# EAGLE schematic HElikopterPlusKomplett (EAGLE 7.5.0)

## Sheet 1 of 2: Full Version
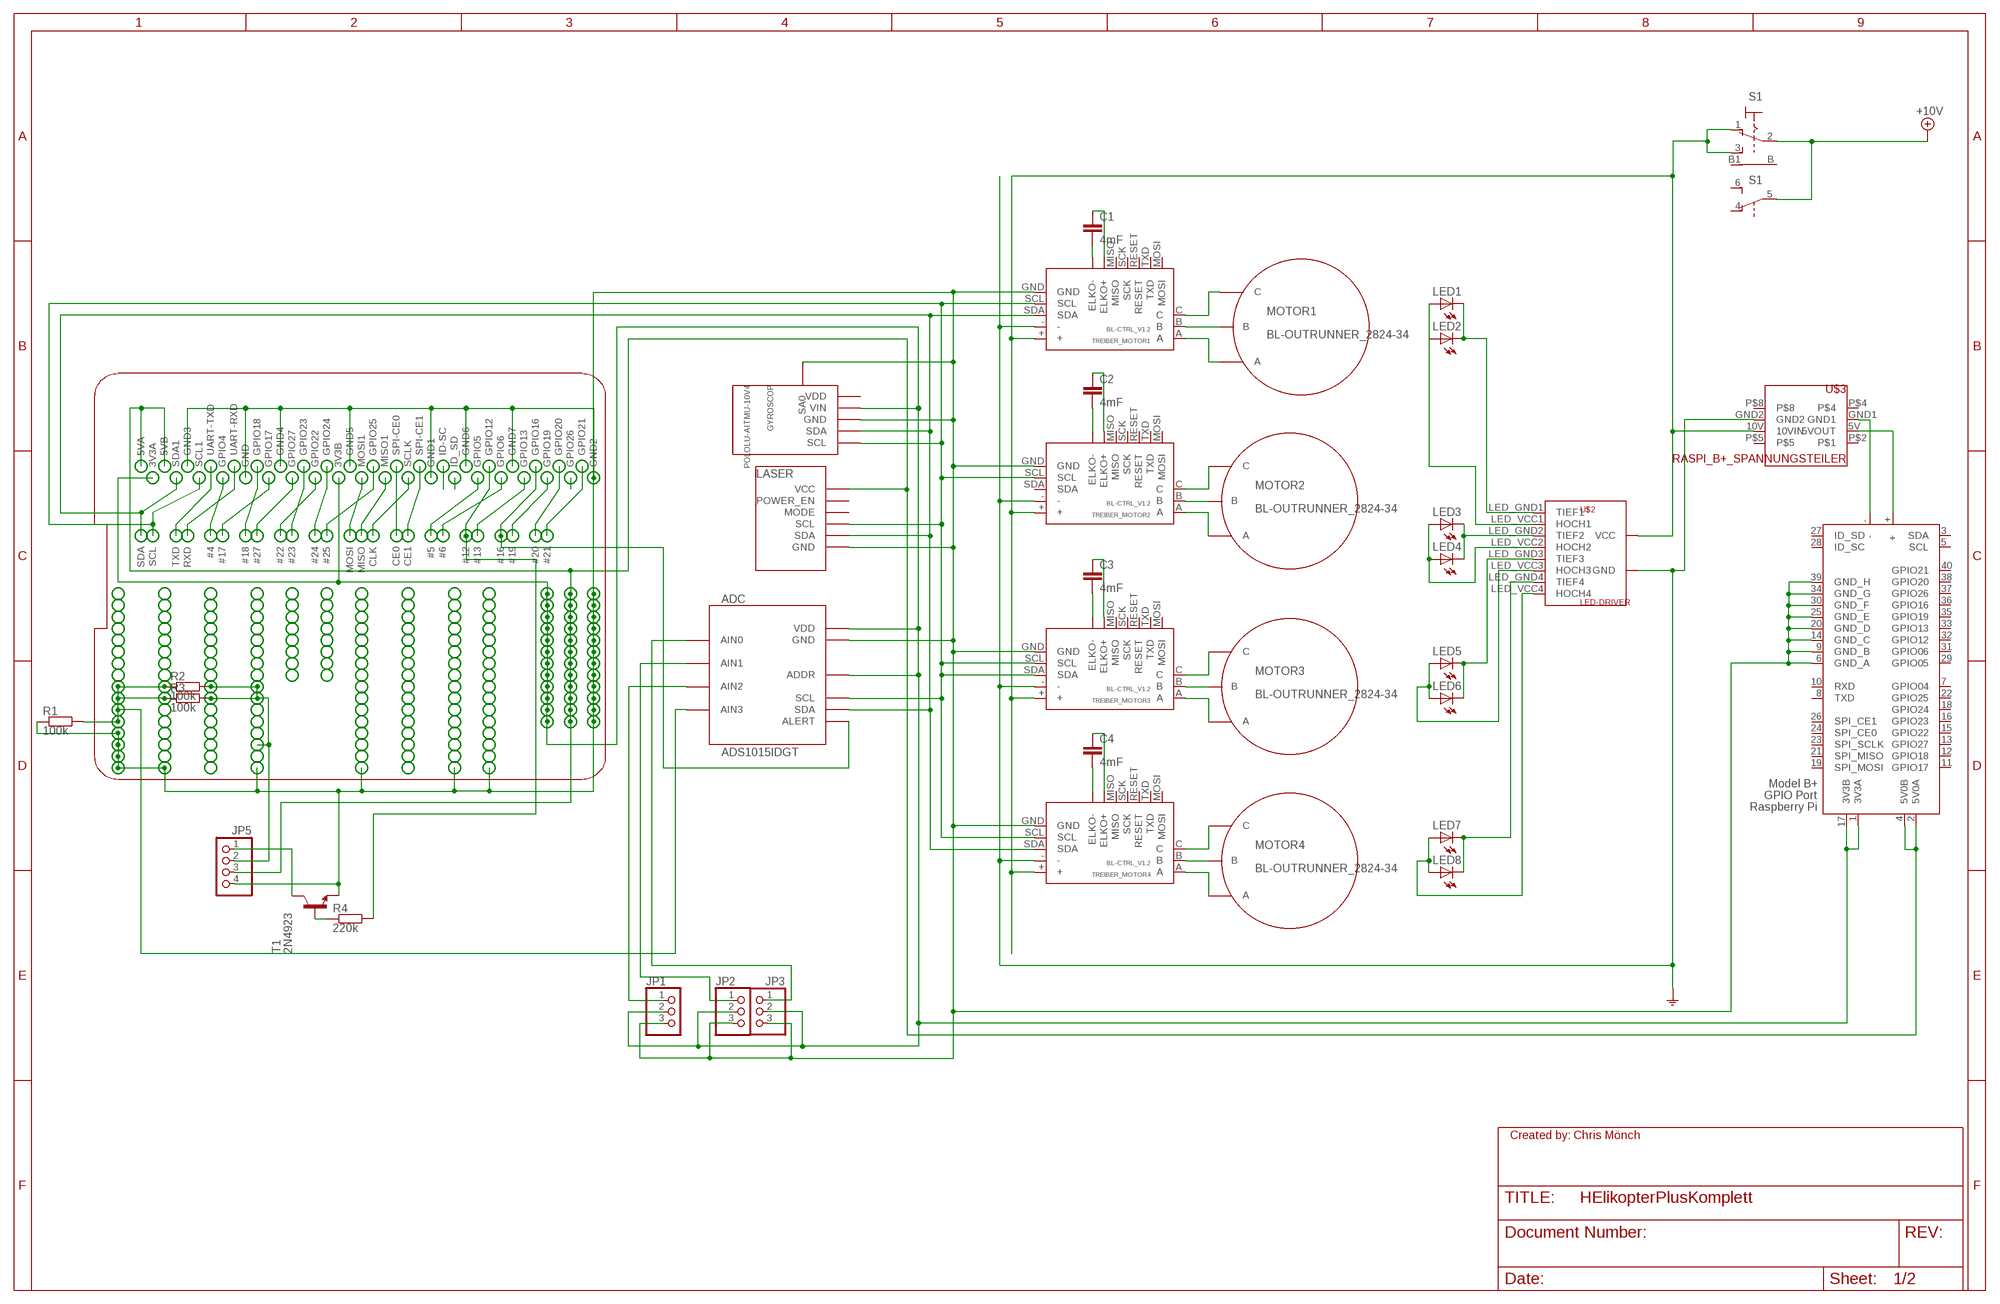
[diagram p0: schematic, sheet 1]

### Parts
ADC  ADS1015IDGT  [MSOP10_0.5]
C1  4mF  C2.5/2  [C2.5-2]
C2  4mF  C2.5/2  [C2.5-2]
C3  4mF  C2.5/2  [C2.5-2]
C4  4mF  C2.5/2  [C2.5-2]
GYROSCOP  POLOLU-AITMU-10V4  [POLOLU-AITMU-10V4]
JP1  PINHD-1X3/90  [1X03/90]
JP2  PINHD-1X3/90  [1X03/90]
JP3  PINHD-1X3/90  [1X03/90]
JP5  PINHD-1X4/90  [1X04/90]
LASER  LIDARLIGHT  [LIDARLIGHT]
LED1  LEDSFH482  [SFH482]
LED2  LEDSFH482  [SFH482]
LED3  LEDSFH482  [SFH482]
LED4  LEDSFH482  [SFH482]
LED5  LEDSFH482  [SFH482]
LED6  LEDSFH482  [SFH482]
LED7  LEDSFH482  [SFH482]
LED8  LEDSFH482  [SFH482]
MOTOR1  BL-OUTRUNNER_2824-34  [BL-OUTRUNNER_2824-34]
MOTOR2  BL-OUTRUNNER_2824-34  [BL-OUTRUNNER_2824-34]
MOTOR3  BL-OUTRUNNER_2824-34  [BL-OUTRUNNER_2824-34]
MOTOR4  BL-OUTRUNNER_2824-34  [BL-OUTRUNNER_2824-34]
R1  100k  SMS-0  [SMS-0]
R2  100k  SMS-0  [SMS-0]
R3  100k  SMS-0  [SMS-0]
R4  220k  SMS-0  [SMS-0]
S1  9070-2W  [9070-2W]
T1  2N4923  [TO126]
TREIBER_MOTOR1  BL-CTRL_V1.2  [BL-CTRL_V1.2]
TREIBER_MOTOR2  BL-CTRL_V1.2  [BL-CTRL_V1.2]
TREIBER_MOTOR3  BL-CTRL_V1.2  [BL-CTRL_V1.2]
TREIBER_MOTOR4  BL-CTRL_V1.2  [BL-CTRL_V1.2]
U$1  ULITMATE-GPS-PI-HAT  [ULITMATE-GPS-PI-HAT]
U$2  LED-DRIVER  [LED-DRIVER]
U$3  RASPI_B+_SPANNUNGSTEILER  [RASPI_B+_SPANNUNGSTEILER]
U$4  GND  [PWR]
X1  RASPI_BOARD_B+#_F  [RASPI_BOARD_B+_FULL]

### Nets
3V3: ADC.1(ADDR) ADC.8(VDD) GYROSCOP.VIN JP1.2 JP2.2 JP3.2 U$1.P$21(3V3A) U$1.P$29(3V3B) U$1.P$90 U$1.P$91 U$1.P$92 U$1.P$93 U$1.P$94 U$1.P$95 U$1.P$96 U$1.P$97 U$1.P$98 U$1.P$99 U$1.P$100 U$1.P$101 ; also sheet 2
5V: JP5.3 LASER.PIN1(VCC) U$1.P$1(5VA) U$1.P$2(5VB) U$1.P$78 U$1.P$79 U$1.P$80 U$1.P$81 U$1.P$82 U$1.P$83 U$1.P$84 U$1.P$85 U$1.P$86 U$1.P$87 U$1.P$88 U$1.P$89 X1.2(5V0A) X1.4(5V0B)
10V: S1.1(1:O) S1.3(1:S) TREIBER_MOTOR1.+ TREIBER_MOTOR2.+ TREIBER_MOTOR3.+ TREIBER_MOTOR4.+ U$2.VCC U$3.10V(10VIN)
+10V: S1.2(1:P) S1.5(B:P) ; also sheet 2
GND: ADC.3(GND) GYROSCOP.GND GYROSCOP.SA0 JP1.3 JP2.3 JP3.3 JP5.4 LASER.PIN6(GND) R1.2 T1.1(E) TREIBER_MOTOR1.GND TREIBER_MOTOR2.GND TREIBER_MOTOR3.GND TREIBER_MOTOR4.GND U$1.P$3(GND3) U$1.P$7(GND4) U$1.P$10(GND5) U$1.P$15(GND6) U$1.P$17(GND7) U$1.P$25(GND) U$1.P$33(GND1) U$1.P$40(GND2) U$1.P$53 U$1.P$54 U$1.P$55 U$1.P$56 U$1.P$66 U$1.P$67 U$1.P$68 U$1.P$69 U$1.P$70 U$1.P$71 U$1.P$72 U$1.P$73 U$1.P$74 U$1.P$75 U$1.P$76 U$1.P$77 U$1.P$108 U$1.P$140 U$1.P$172 U$1.P$204 U$1.P$220 X1.6(GND_A) X1.9(GND_B) X1.14(GND_C) X1.20(GND_D) X1.25(GND_E) X1.30(GND_F) X1.34(GND_G) X1.39(GND_H) ; also sheet 2
N$1: ADC.7(AIN3) R1.1 R2.2 R3.2 U$1.P$49 U$1.P$50 U$1.P$51 U$1.P$52 U$1.P$65 U$1.P$102
N$3: U$1.P$4(UART-TXD)
N$4: MOTOR1.A(C) TREIBER_MOTOR1.C
N$5: MOTOR1.B TREIBER_MOTOR1.B
N$6: MOTOR1.C(A) TREIBER_MOTOR1.A
N$7: MOTOR2.A(C) TREIBER_MOTOR2.C
N$8: MOTOR2.B TREIBER_MOTOR2.B
N$9: MOTOR2.C(A) TREIBER_MOTOR2.A
N$10: MOTOR4.B TREIBER_MOTOR4.B
N$11: MOTOR3.B TREIBER_MOTOR3.B
N$12: MOTOR3.A(C) TREIBER_MOTOR3.C
N$13: MOTOR3.C(A) TREIBER_MOTOR3.A
N$14: MOTOR4.A(C) TREIBER_MOTOR4.C
N$15: MOTOR4.C(A) TREIBER_MOTOR4.A
N$16: R4.2 T1.3(B)
N$17: U$1.P$5(UART-RXD)
N$18: JP5.2 R2.1 R3.1 U$1.P$117 U$1.P$118 U$1.P$133 U$1.P$134 U$1.P$138
N$20: JP5.1 T1.2(C)
N$21: LED1.K(C) LED2.K(C) U$2.LED_GND1(TIEF1)
N$22: ADC.6(AIN2) JP1.1
N$23: ADC.5(AIN1) JP2.1
N$24: ADC.4(AIN0) JP3.1
N$25: LED3.K(C) LED4.K(C) U$2.LED_GND2(TIEF2)
N$26: U$1.P$31(MISO1)
N$27: LED3.A LED4.A U$2.LED_VCC2(HOCH2)
N$28: LED5.A LED6.A U$2.LED_VCC3(HOCH3)
N$29: LED5.K(C) LED6.K(C) U$2.LED_GND3(TIEF3)
N$30: U$1.P$14(ID-SC)
N$31: U$1.P$34(ID_SD)
N$32: LED7.K(C) LED8.K(C) U$2.LED_GND4(TIEF4)
N$33: LED7.A LED8.A U$2.LED_VCC4(HOCH4)
N$34: TREIBER_MOTOR1.- TREIBER_MOTOR2.- TREIBER_MOTOR3.- TREIBER_MOTOR4.- U$2.GND U$3.GND2 U$4.P$1
N$35: U$3.5V(5VOUT) X1.+
N$36: U$3.GND1 X1.-
N$37: C2.2 TREIBER_MOTOR2.ELKO-
N$38: C2.1 TREIBER_MOTOR2.ELKO+
N$39: U$1.P$39(GPIO26)
N$40: C3.2 TREIBER_MOTOR3.ELKO-
N$41: U$1.#21 U$1.P$20(GPIO21)
N$42: U$1.#20 U$1.P$19(GPIO20)
N$43: U$1.#19 U$1.P$38(GPIO19)
N$44: ADC.2(ALERT) U$1.#16 U$1.P$18(GPIO16)
N$45: U$1.#13 U$1.P$37(GPIO13)
N$46: R4.1 U$1.#12 U$1.P$16(GPIO12)
N$47: U$1.#6 U$1.P$36(GPIO6)
N$48: U$1.#5 U$1.P$35(GPIO5)
N$49: U$1.CE1 U$1.P$13(SPI-CE1)
N$50: U$1.CE0 U$1.P$12(SPI-CE0)
N$51: U$1.CLK U$1.P$32(SCLK)
N$52: U$1.MISO
N$53: U$1.MOSI U$1.P$30(MOSI1)
N$54: U$1.#25 U$1.P$11(GPIO25)
N$55: U$1.#24 U$1.P$9(GPIO24)
N$56: U$1.#23 U$1.P$8(GPIO23)
N$57: U$1.#22 U$1.P$28(GPIO22)
N$58: U$1.27(#27) U$1.P$27(GPIO27)
N$59: U$1.#18 U$1.P$6(GPIO18)
N$60: U$1.#17 U$1.P$26(GPIO17)
N$61: U$1.#4 U$1.P$24(GPIO4)
N$62: U$1.RXD
N$63: U$1.TXD
N$64: C3.1 TREIBER_MOTOR3.ELKO+
N$65: C4.2 TREIBER_MOTOR4.ELKO-
N$66: C4.1 TREIBER_MOTOR4.ELKO+
N$67: C1.2 TREIBER_MOTOR1.ELKO-
N$68: C1.1 TREIBER_MOTOR1.ELKO+
N$69: LED1.A LED2.A U$2.LED_VCC1(HOCH1)
N$138: X1.1(3V3A) X1.17(3V3B)
SCL: ADC.10(SCL) GYROSCOP.SCL LASER.PIN4(SCL) TREIBER_MOTOR1.SCL TREIBER_MOTOR2.SCL TREIBER_MOTOR3.SCL TREIBER_MOTOR3.SDA TREIBER_MOTOR4.SCL U$1.P$23(SCL1) U$1.SCL
SDA: ADC.9(SDA) GYROSCOP.SDA LASER.PIN5(SDA) TREIBER_MOTOR1.SDA TREIBER_MOTOR4.SDA U$1.P$22(SDA1) U$1.SDA
Unconnected: LASER.PIN2(POWER_EN) LASER.PIN3(MODE) S1.4(B:O) S1.6(B:S) S1.B1(1:B1) S1.B(1:B) TREIBER_MOTOR1.MISO TREIBER_MOTOR1.MOSI TREIBER_MOTOR1.RESET TREIBER_MOTOR1.SCK TREIBER_MOTOR1.TXD TREIBER_MOTOR2.MISO TREIBER_MOTOR2.MOSI TREIBER_MOTOR2.RESET TREIBER_MOTOR2.SCK TREIBER_MOTOR2.SDA TREIBER_MOTOR2.TXD TREIBER_MOTOR3.MISO TREIBER_MOTOR3.MOSI TREIBER_MOTOR3.RESET TREIBER_MOTOR3.SCK TREIBER_MOTOR3.TXD TREIBER_MOTOR4.MISO TREIBER_MOTOR4.MOSI TREIBER_MOTOR4.RESET TREIBER_MOTOR4.SCK TREIBER_MOTOR4.TXD U$1.P$41 U$1.P$42 U$1.P$43 U$1.P$44 U$1.P$45 U$1.P$46 U$1.P$47 U$1.P$48 U$1.P$57 U$1.P$58 U$1.P$59 U$1.P$60 U$1.P$61 U$1.P$62 U$1.P$63 U$1.P$64 U$1.P$103 U$1.P$104 U$1.P$105 U$1.P$106 U$1.P$107 U$1.P$109 U$1.P$110 U$1.P$111 U$1.P$112 U$1.P$113 U$1.P$114 U$1.P$115 U$1.P$116 U$1.P$119 U$1.P$120 U$1.P$121 U$1.P$122 U$1.P$123 U$1.P$124 U$1.P$125 U$1.P$126 U$1.P$127 U$1.P$128 U$1.P$129 U$1.P$130 U$1.P$131 U$1.P$132 U$1.P$135 U$1.P$136 U$1.P$137 U$1.P$139 U$1.P$141 U$1.P$142 U$1.P$143 U$1.P$144 U$1.P$145 U$1.P$146 U$1.P$147 U$1.P$148 U$1.P$149 U$1.P$150 U$1.P$151 U$1.P$152 U$1.P$153 U$1.P$154 U$1.P$155 U$1.P$156 U$1.P$157 U$1.P$158 U$1.P$159 U$1.P$160 U$1.P$161 U$1.P$162 U$1.P$163 U$1.P$164 U$1.P$165 U$1.P$166 U$1.P$167 U$1.P$168 U$1.P$169 U$1.P$170 U$1.P$171 U$1.P$173 U$1.P$174 U$1.P$175 U$1.P$176 U$1.P$177 U$1.P$178 U$1.P$179 U$1.P$180 U$1.P$181 U$1.P$182 U$1.P$183 U$1.P$184 U$1.P$185 U$1.P$186 U$1.P$187 U$1.P$188 U$1.P$189 U$1.P$190 U$1.P$191 U$1.P$192 U$1.P$193 U$1.P$194 U$1.P$195 U$1.P$196 U$1.P$197 U$1.P$198 U$1.P$199 U$1.P$200 U$1.P$201 U$1.P$202 U$1.P$203 U$1.P$205 U$1.P$206 U$1.P$207 U$1.P$208 U$1.P$209 U$1.P$210 U$1.P$211 U$1.P$212 U$1.P$213 U$1.P$214 U$1.P$215 U$1.P$216 U$1.P$217 U$1.P$218 U$1.P$219 U$3.P$2 U$3.P$4 U$3.P$5 U$3.P$8 X1.3(SDA) X1.5(SCL) X1.7(GPIO04) X1.8(TXD) X1.10(RXD) X1.11(GPIO17) X1.12(GPIO18) X1.13(GPIO27) X1.15(GPIO22) X1.16(GPIO23) X1.18(GPIO24) X1.19(SPI_MOSI) X1.21(SPI_MISO) X1.22(GPIO25) X1.23(SPI_SCLK) X1.24(SPI_CE0) X1.26(SPI_CE1) X1.27(ID_SD) X1.28(ID_SC) X1.29(GPIO05) X1.31(GPIO06) X1.32(GPIO12) X1.33(GPIO13) X1.35(GPIO19) X1.36(GPIO16) X1.37(GPIO26) X1.38(GPIO20) X1.40(GPIO21)

### Notes on the sheet
- Created by: Chris Mönch

## Sheet 2 of 2: Print Version/ Splitted in 2 Frames
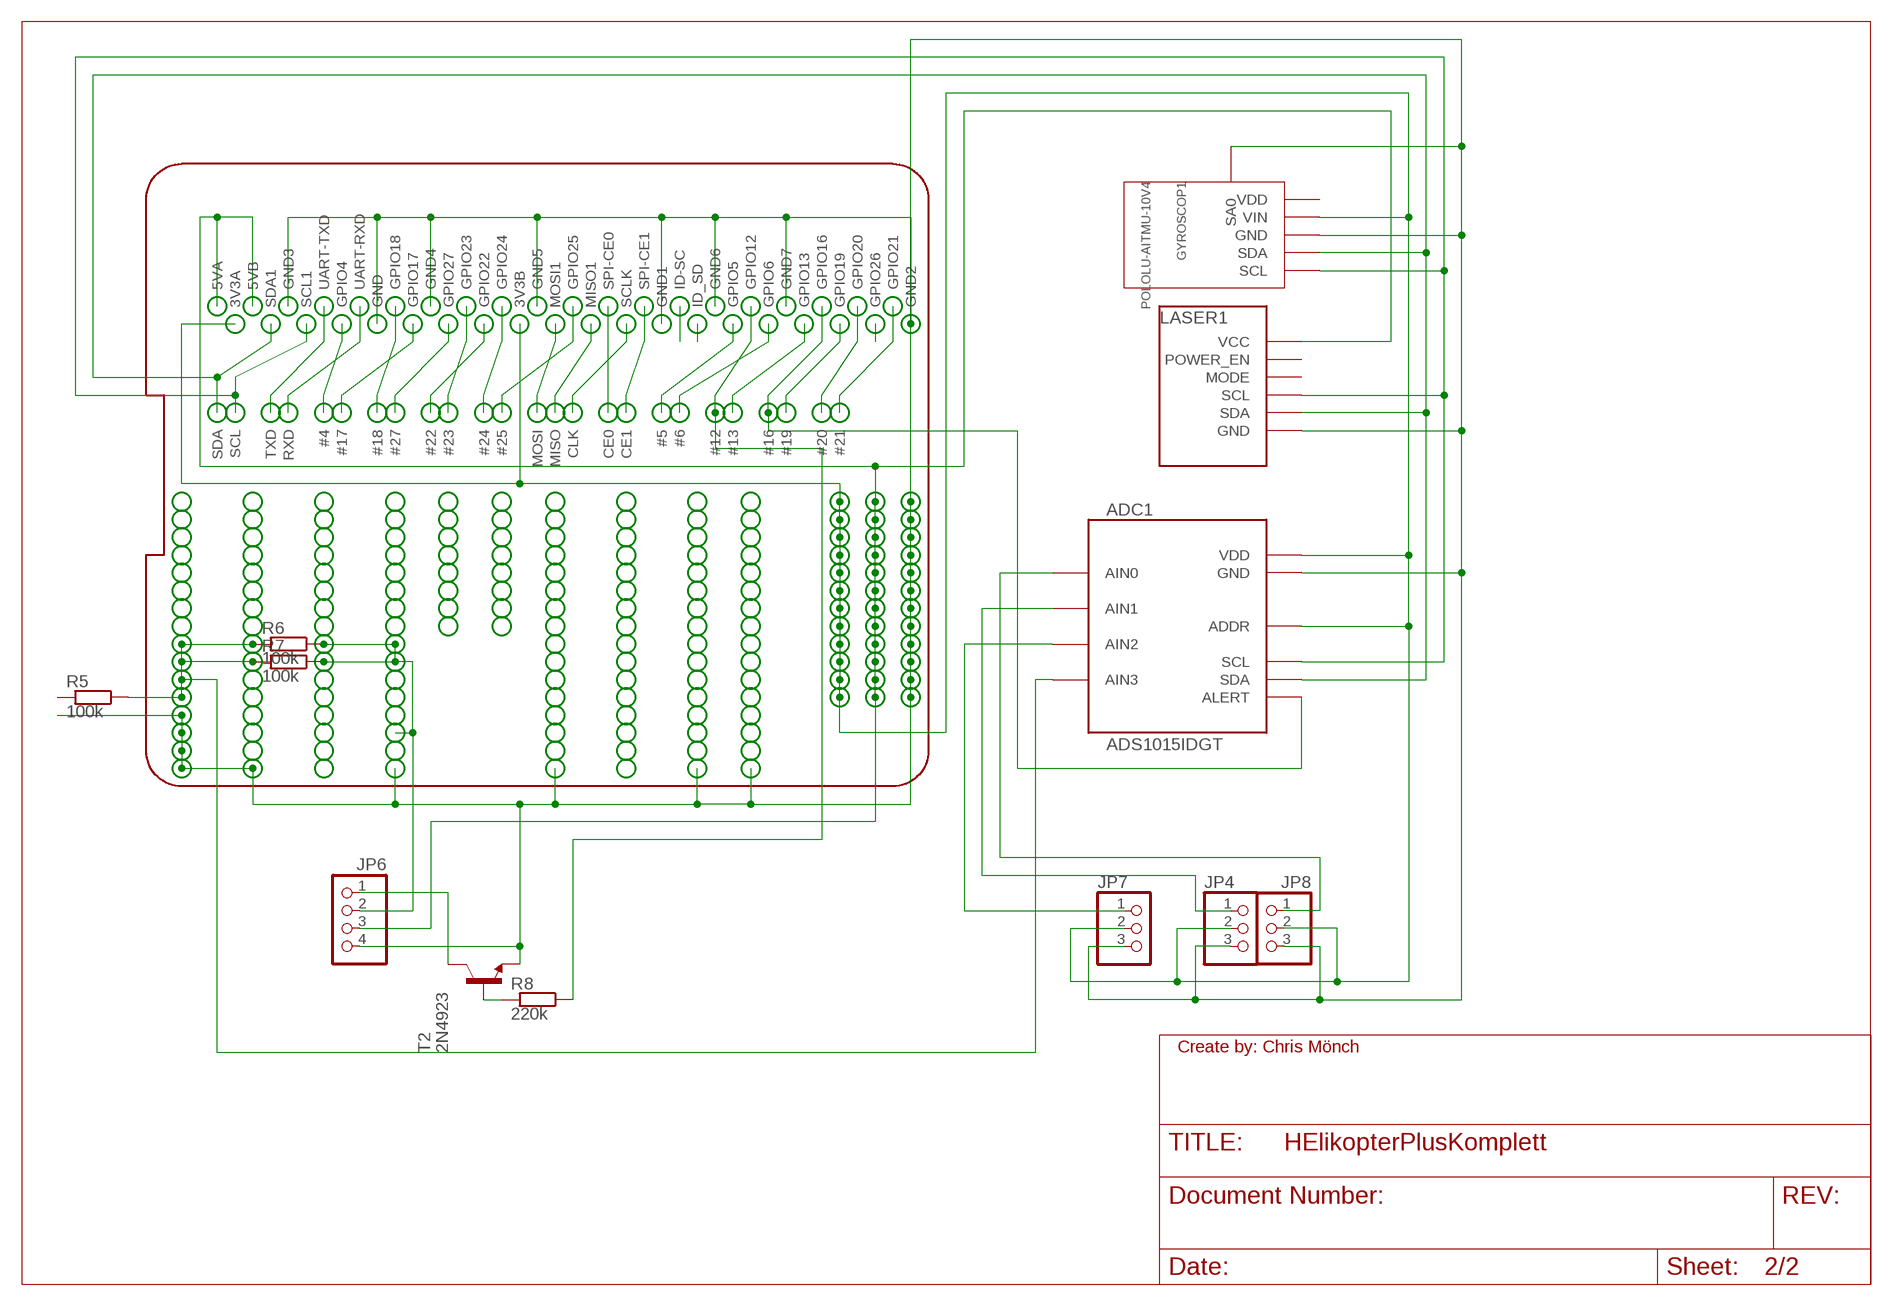
[diagram p1: schematic, sheet 2, part 1 of 2]
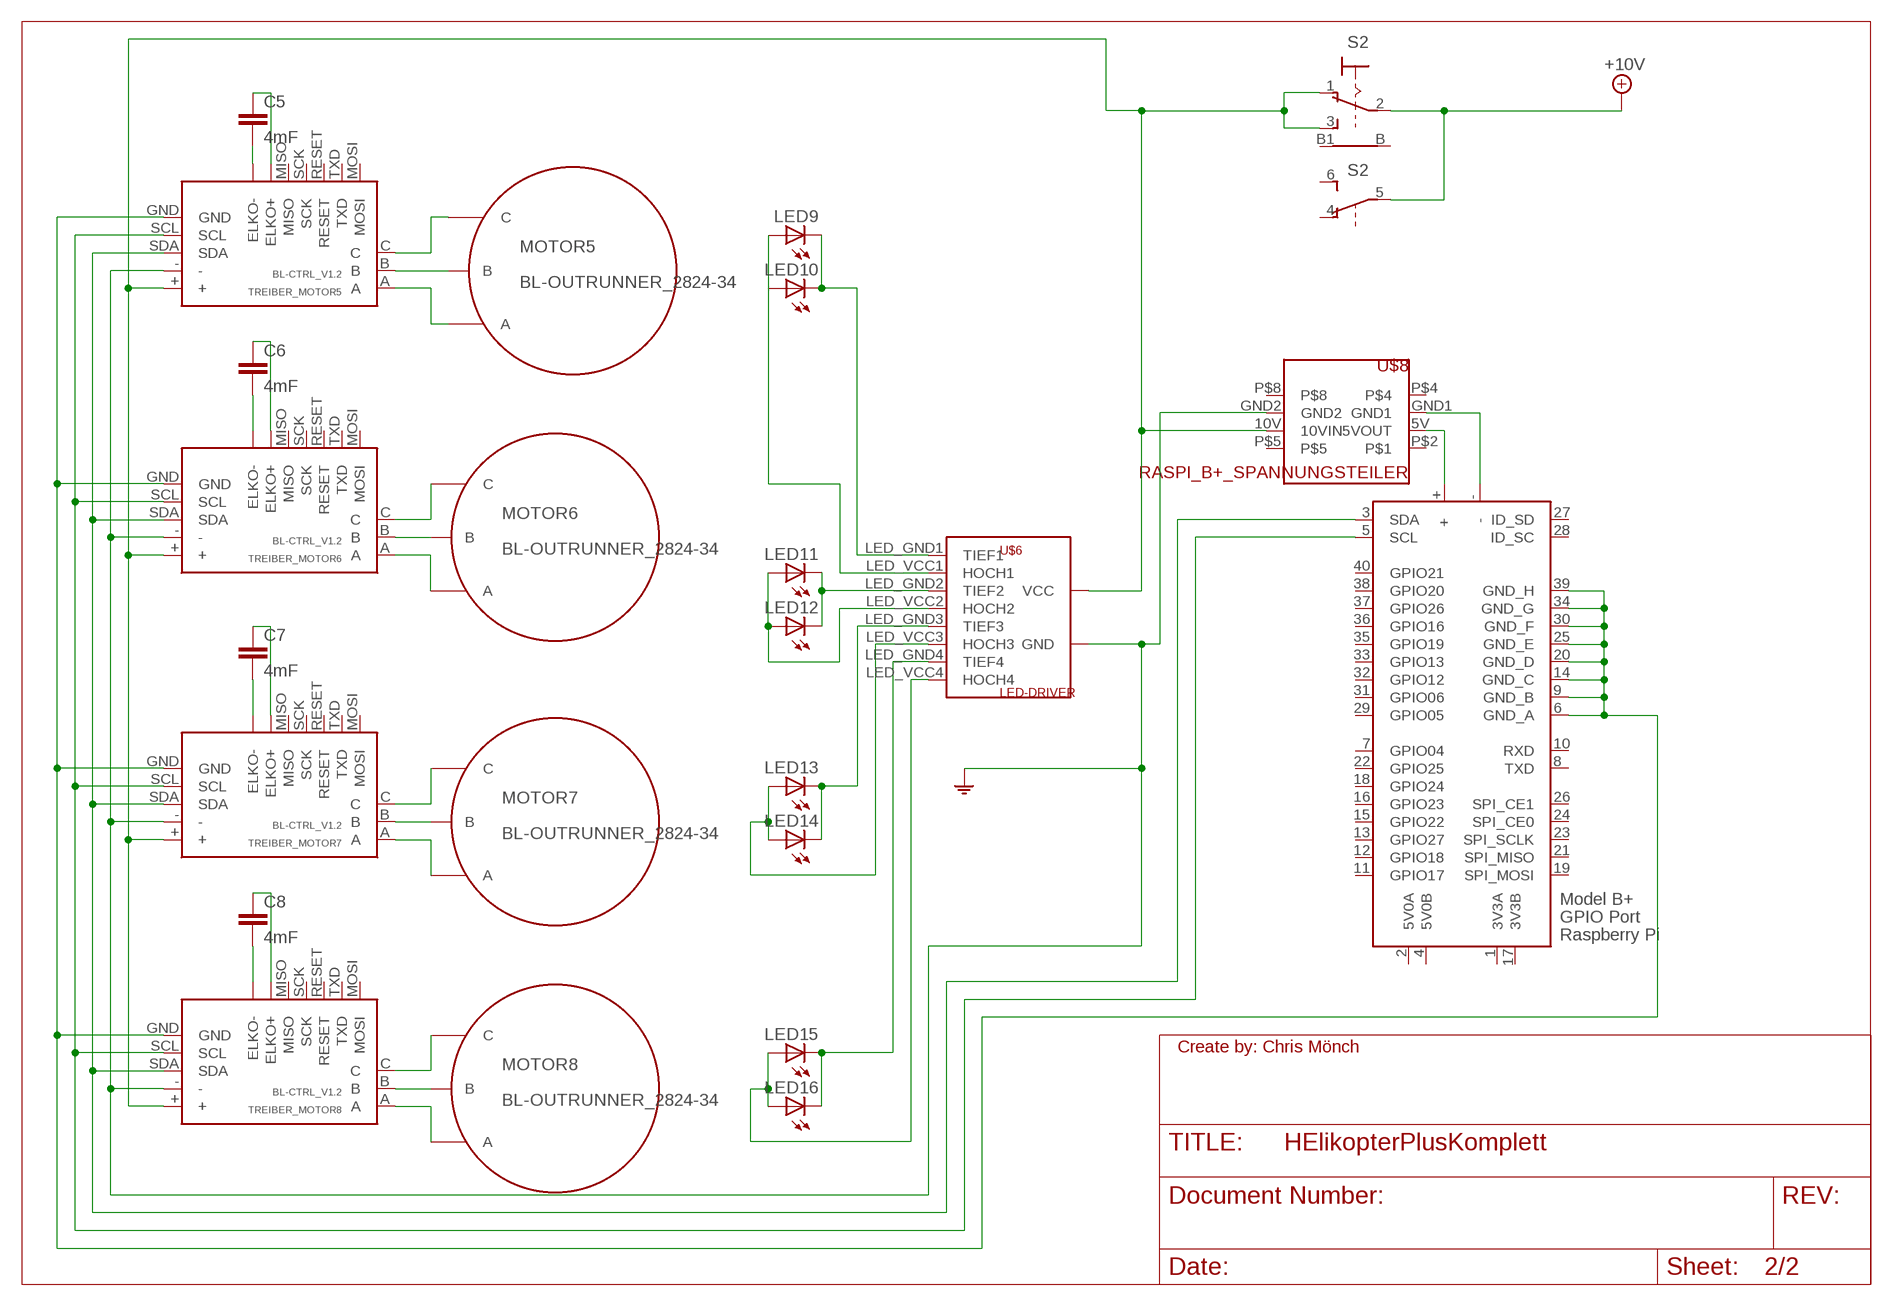
[diagram p2: schematic, sheet 2, part 2 of 2]

### Parts
ADC1  ADS1015IDGT  [MSOP10_0.5]
C5  4mF  C2.5/2  [C2.5-2]
C6  4mF  C2.5/2  [C2.5-2]
C7  4mF  C2.5/2  [C2.5-2]
C8  4mF  C2.5/2  [C2.5-2]
GYROSCOP1  POLOLU-AITMU-10V4  [POLOLU-AITMU-10V4]
JP4  PINHD-1X3/90  [1X03/90]
JP6  PINHD-1X4/90  [1X04/90]
JP7  PINHD-1X3/90  [1X03/90]
JP8  PINHD-1X3/90  [1X03/90]
LASER1  LIDARLIGHT  [LIDARLIGHT]
LED9  LEDSFH482  [SFH482]
LED10  LEDSFH482  [SFH482]
LED11  LEDSFH482  [SFH482]
LED12  LEDSFH482  [SFH482]
LED13  LEDSFH482  [SFH482]
LED14  LEDSFH482  [SFH482]
LED15  LEDSFH482  [SFH482]
LED16  LEDSFH482  [SFH482]
MOTOR5  BL-OUTRUNNER_2824-34  [BL-OUTRUNNER_2824-34]
MOTOR6  BL-OUTRUNNER_2824-34  [BL-OUTRUNNER_2824-34]
MOTOR7  BL-OUTRUNNER_2824-34  [BL-OUTRUNNER_2824-34]
MOTOR8  BL-OUTRUNNER_2824-34  [BL-OUTRUNNER_2824-34]
R5  100k  SMS-0  [SMS-0]
R6  100k  SMS-0  [SMS-0]
R7  100k  SMS-0  [SMS-0]
R8  220k  SMS-0  [SMS-0]
S2  9070-2W  [9070-2W]
T2  2N4923  [TO126]
TREIBER_MOTOR5  BL-CTRL_V1.2  [BL-CTRL_V1.2]
TREIBER_MOTOR6  BL-CTRL_V1.2  [BL-CTRL_V1.2]
TREIBER_MOTOR7  BL-CTRL_V1.2  [BL-CTRL_V1.2]
TREIBER_MOTOR8  BL-CTRL_V1.2  [BL-CTRL_V1.2]
U$5  ULITMATE-GPS-PI-HAT  [ULITMATE-GPS-PI-HAT]
U$6  LED-DRIVER  [LED-DRIVER]
U$7  GND  [PWR]
U$8  RASPI_B+_SPANNUNGSTEILER  [RASPI_B+_SPANNUNGSTEILER]
X2  RASPI_BOARD_B+#_F  [RASPI_BOARD_B+_FULL]

### Nets
3V3: ADC1.1(ADDR) ADC1.8(VDD) GYROSCOP1.VIN JP4.2 JP7.2 JP8.2 U$5.P$21(3V3A) U$5.P$29(3V3B) U$5.P$90 U$5.P$91 U$5.P$92 U$5.P$93 U$5.P$94 U$5.P$95 U$5.P$96 U$5.P$97 U$5.P$98 U$5.P$99 U$5.P$100 U$5.P$101 ; also sheet 1
10V1: S2.1(1:O) S2.3(1:S) TREIBER_MOTOR5.+ TREIBER_MOTOR6.+ TREIBER_MOTOR7.+ TREIBER_MOTOR8.+ U$6.VCC U$8.10V(10VIN)
+10V: S2.2(1:P) S2.5(B:P) ; also sheet 1
GND: ADC1.3(GND) GYROSCOP1.GND GYROSCOP1.SA0 JP4.3 JP6.4 JP7.3 JP8.3 LASER1.PIN6(GND) T2.1(E) U$5.P$3(GND3) U$5.P$7(GND4) U$5.P$10(GND5) U$5.P$15(GND6) U$5.P$17(GND7) U$5.P$25(GND) U$5.P$33(GND1) U$5.P$40(GND2) U$5.P$53 U$5.P$54 U$5.P$55 U$5.P$56 U$5.P$66 U$5.P$67 U$5.P$68 U$5.P$69 U$5.P$70 U$5.P$71 U$5.P$72 U$5.P$73 U$5.P$74 U$5.P$75 U$5.P$76 U$5.P$77 U$5.P$108 U$5.P$140 U$5.P$172 U$5.P$204 U$5.P$220 ; also sheet 1
GND1: TREIBER_MOTOR5.GND TREIBER_MOTOR6.GND TREIBER_MOTOR7.GND TREIBER_MOTOR8.GND X2.6(GND_A) X2.9(GND_B) X2.14(GND_C) X2.20(GND_D) X2.25(GND_E) X2.30(GND_F) X2.34(GND_G) X2.39(GND_H)
N$19: JP6.3 LASER1.PIN1(VCC) U$5.P$1(5VA) U$5.P$2(5VB) U$5.P$78 U$5.P$79 U$5.P$80 U$5.P$81 U$5.P$82 U$5.P$83 U$5.P$84 U$5.P$85 U$5.P$86 U$5.P$87 U$5.P$88 U$5.P$89
N$70: U$5.P$4(UART-TXD)
N$71: U$5.P$5(UART-RXD)
N$72: U$5.P$31(MISO1)
N$73: U$5.P$14(ID-SC)
N$74: U$5.P$34(ID_SD)
N$75: U$5.P$39(GPIO26)
N$76: U$5.#21 U$5.P$20(GPIO21)
N$77: U$5.#20 U$5.P$19(GPIO20)
N$78: U$5.#19 U$5.P$38(GPIO19)
N$79: ADC1.2(ALERT) U$5.#16 U$5.P$18(GPIO16)
N$80: U$5.#13 U$5.P$37(GPIO13)
N$81: R8.1 U$5.#12 U$5.P$16(GPIO12)
N$82: U$5.#6 U$5.P$36(GPIO6)
N$83: U$5.#5 U$5.P$35(GPIO5)
N$84: U$5.CE1 U$5.P$13(SPI-CE1)
N$85: U$5.CE0 U$5.P$12(SPI-CE0)
N$86: U$5.CLK U$5.P$32(SCLK)
N$87: U$5.MISO
N$88: U$5.MOSI U$5.P$30(MOSI1)
N$89: U$5.#25 U$5.P$11(GPIO25)
N$90: U$5.#24 U$5.P$9(GPIO24)
N$91: U$5.#23 U$5.P$8(GPIO23)
N$92: U$5.#22 U$5.P$28(GPIO22)
N$93: U$5.27(#27) U$5.P$27(GPIO27)
N$94: U$5.#18 U$5.P$6(GPIO18)
N$95: U$5.#17 U$5.P$26(GPIO17)
N$96: U$5.#4 U$5.P$24(GPIO4)
N$97: U$5.RXD
N$98: U$5.TXD
N$99: ADC1.7(AIN3) R5.1 R6.2 R7.2 U$5.P$49 U$5.P$50 U$5.P$51 U$5.P$52 U$5.P$65 U$5.P$102
N$100: JP6.2 R6.1 R7.1 U$5.P$117 U$5.P$118 U$5.P$133 U$5.P$134 U$5.P$138
N$101: JP6.1 T2.2(C)
N$102: R8.2 T2.3(B)
N$103: ADC1.6(AIN2) JP7.1
N$104: ADC1.5(AIN1) JP4.1
N$105: ADC1.4(AIN0) JP8.1
N$106: MOTOR5.A(C) TREIBER_MOTOR5.C
N$107: MOTOR5.B TREIBER_MOTOR5.B
N$108: MOTOR5.C(A) TREIBER_MOTOR5.A
N$109: MOTOR6.A(C) TREIBER_MOTOR6.C
N$110: MOTOR6.B TREIBER_MOTOR6.B
N$111: MOTOR6.C(A) TREIBER_MOTOR6.A
N$112: MOTOR7.B TREIBER_MOTOR7.B
N$113: MOTOR8.B TREIBER_MOTOR8.B
N$114: MOTOR7.A(C) TREIBER_MOTOR7.C
N$115: MOTOR7.C(A) TREIBER_MOTOR7.A
N$116: MOTOR8.A(C) TREIBER_MOTOR8.C
N$117: MOTOR8.C(A) TREIBER_MOTOR8.A
N$118: LED9.K(C) LED10.K(C) U$6.LED_GND1(TIEF1)
N$119: LED11.K(C) LED12.K(C) U$6.LED_GND2(TIEF2)
N$120: LED11.A LED12.A U$6.LED_VCC2(HOCH2)
N$121: LED13.A LED14.A U$6.LED_VCC3(HOCH3)
N$122: LED13.K(C) LED14.K(C) U$6.LED_GND3(TIEF3)
N$123: LED15.K(C) LED16.K(C) U$6.LED_GND4(TIEF4)
N$124: LED15.A LED16.A U$6.LED_VCC4(HOCH4)
N$125: TREIBER_MOTOR5.- TREIBER_MOTOR6.- TREIBER_MOTOR7.- TREIBER_MOTOR8.- U$6.GND U$7.P$1 U$8.GND2
N$126: U$8.5V(5VOUT) X2.+
N$127: U$8.GND1 X2.-
N$128: C6.2 TREIBER_MOTOR6.ELKO-
N$129: C6.1 TREIBER_MOTOR6.ELKO+
N$130: C7.2 TREIBER_MOTOR7.ELKO-
N$131: C7.1 TREIBER_MOTOR7.ELKO+
N$132: C8.2 TREIBER_MOTOR8.ELKO-
N$133: C8.1 TREIBER_MOTOR8.ELKO+
N$134: C5.2 TREIBER_MOTOR5.ELKO-
N$135: C5.1 TREIBER_MOTOR5.ELKO+
N$136: LED9.A LED10.A U$6.LED_VCC1(HOCH1)
N$137: TREIBER_MOTOR5.SDA TREIBER_MOTOR6.SDA TREIBER_MOTOR7.SDA TREIBER_MOTOR8.SDA X2.3(SDA)
SCL1: ADC1.10(SCL) GYROSCOP1.SCL LASER1.PIN4(SCL) U$5.P$23(SCL1) U$5.SCL
SDA1: ADC1.9(SDA) GYROSCOP1.SDA LASER1.PIN5(SDA) U$5.P$22(SDA1) U$5.SDA
SDA2: TREIBER_MOTOR5.SCL TREIBER_MOTOR6.SCL TREIBER_MOTOR7.SCL TREIBER_MOTOR8.SCL X2.5(SCL)
Unconnected: LASER1.PIN2(POWER_EN) LASER1.PIN3(MODE) R5.2 S2.4(B:O) S2.6(B:S) S2.B1(1:B1) S2.B(1:B) TREIBER_MOTOR5.MISO TREIBER_MOTOR5.MOSI TREIBER_MOTOR5.RESET TREIBER_MOTOR5.SCK TREIBER_MOTOR5.TXD TREIBER_MOTOR6.MISO TREIBER_MOTOR6.MOSI TREIBER_MOTOR6.RESET TREIBER_MOTOR6.SCK TREIBER_MOTOR6.TXD TREIBER_MOTOR7.MISO TREIBER_MOTOR7.MOSI TREIBER_MOTOR7.RESET TREIBER_MOTOR7.SCK TREIBER_MOTOR7.TXD TREIBER_MOTOR8.MISO TREIBER_MOTOR8.MOSI TREIBER_MOTOR8.RESET TREIBER_MOTOR8.SCK TREIBER_MOTOR8.TXD U$5.P$41 U$5.P$42 U$5.P$43 U$5.P$44 U$5.P$45 U$5.P$46 U$5.P$47 U$5.P$48 U$5.P$57 U$5.P$58 U$5.P$59 U$5.P$60 U$5.P$61 U$5.P$62 U$5.P$63 U$5.P$64 U$5.P$103 U$5.P$104 U$5.P$105 U$5.P$106 U$5.P$107 U$5.P$109 U$5.P$110 U$5.P$111 U$5.P$112 U$5.P$113 U$5.P$114 U$5.P$115 U$5.P$116 U$5.P$119 U$5.P$120 U$5.P$121 U$5.P$122 U$5.P$123 U$5.P$124 U$5.P$125 U$5.P$126 U$5.P$127 U$5.P$128 U$5.P$129 U$5.P$130 U$5.P$131 U$5.P$132 U$5.P$135 U$5.P$136 U$5.P$137 U$5.P$139 U$5.P$141 U$5.P$142 U$5.P$143 U$5.P$144 U$5.P$145 U$5.P$146 U$5.P$147 U$5.P$148 U$5.P$149 U$5.P$150 U$5.P$151 U$5.P$152 U$5.P$153 U$5.P$154 U$5.P$155 U$5.P$156 U$5.P$157 U$5.P$158 U$5.P$159 U$5.P$160 U$5.P$161 U$5.P$162 U$5.P$163 U$5.P$164 U$5.P$165 U$5.P$166 U$5.P$167 U$5.P$168 U$5.P$169 U$5.P$170 U$5.P$171 U$5.P$173 U$5.P$174 U$5.P$175 U$5.P$176 U$5.P$177 U$5.P$178 U$5.P$179 U$5.P$180 U$5.P$181 U$5.P$182 U$5.P$183 U$5.P$184 U$5.P$185 U$5.P$186 U$5.P$187 U$5.P$188 U$5.P$189 U$5.P$190 U$5.P$191 U$5.P$192 U$5.P$193 U$5.P$194 U$5.P$195 U$5.P$196 U$5.P$197 U$5.P$198 U$5.P$199 U$5.P$200 U$5.P$201 U$5.P$202 U$5.P$203 U$5.P$205 U$5.P$206 U$5.P$207 U$5.P$208 U$5.P$209 U$5.P$210 U$5.P$211 U$5.P$212 U$5.P$213 U$5.P$214 U$5.P$215 U$5.P$216 U$5.P$217 U$5.P$218 U$5.P$219 U$8.P$2 U$8.P$4 U$8.P$5 U$8.P$8 X2.7(GPIO04) X2.8(TXD) X2.10(RXD) X2.11(GPIO17) X2.12(GPIO18) X2.13(GPIO27) X2.15(GPIO22) X2.16(GPIO23) X2.18(GPIO24) X2.19(SPI_MOSI) X2.21(SPI_MISO) X2.22(GPIO25) X2.23(SPI_SCLK) X2.24(SPI_CE0) X2.26(SPI_CE1) X2.27(ID_SD) X2.28(ID_SC) X2.29(GPIO05) X2.31(GPIO06) X2.32(GPIO12) X2.33(GPIO13) X2.35(GPIO19) X2.36(GPIO16) X2.37(GPIO26) X2.38(GPIO20) X2.40(GPIO21)

### Notes on the sheet
- Create by: Chris Mönch | Create by: Chris Mönch

## Power pins joined to a net without a drawn wire
3V3A: X2.1(3V3A)
3V3B: X2.17(3V3B)
5V0A: X2.2(5V0A)
5V0B: X2.4(5V0B)
VDD: GYROSCOP1.VDD GYROSCOP.VDD

## Library data of the parts
ADC ADC1 = HElicopterLib:ADS1015: Ti ADS1015 12-bit ADC Ultra-Small, Low-Power, 12-Bit Analog-to-Digital Converter with Internal Reference The ADS1013, ADS1014, and ADS1015 are precision analog-to-digital converters (ADCs) with 12 bits of resolution offered in an ultra-small, leadless QFN-10 package or an MSOP-10 package. \ Source: http://focus.ti.com/docs/prod/folders/print/ads1015.html
C1-C8 = capacitor-wima:C: CAPACITOR naming: grid - package width
GYROSCOP GYROSCOP1 = HElicopterLib:POLOLU-AITMU-10V4
JP1-JP4 JP7 JP8 = pinhead:PINHD-1X3: PIN HEADER
JP5 JP6 = pinhead:PINHD-1X4: PIN HEADER
LASER LASER1 = HElicopterLib:LIDARLIGHT
LED1-LED16 = led:LED: LED OSRAM: - CHIPLED LG R971, LG N971, LY N971, LG Q971, LY Q971, LO R971, LY R971 LH N974, LH R974 LS Q976, LO Q976, LY Q976 LO Q996 - Hyper CHIPLED LW Q18S LB Q993, LB Q99A, LB R99A - SideLED LS A670, LO A670, LY A670, LG A670, LP A670 LB A673, LV A673, LT A673, LW A673 LH A674 LY A675 LS A676, LA A676, LO A676, LY A676, LW A676 LS A679, LY A679, LG A679 - Hyper Micro SIDELED® LS Y876, LA Y876, LO Y876, LY Y876 LT Y87S - SmartLED LW L88C, LW L88S LB L89C, LB L89S, LG L890 LS L89K, LO L89K, LY L89K LS L896, LA L896, LO L896, LY L896 - TOPLED LS T670, LO T670, LY T670, LG T670, LP T670 LSG T670, LSP T670, LSY T670, LOP T670, LYG T670 LG T671, LOG T671, LSG T671 LB T673, LV T673, LT T673, LW T673 LH T674 LS T676, LA T676, LO T676, LY T676, LB T676, LH T676, LSB T676, LW T676 LB T67C, LV T67C, LT T67C, LS T67K, LO T67K, LY T67K, LW E67C LS E67B, LA E67B, LO E67B, LY E67B, LB E67C, LV E67C, LT E67C LW T67C LS T679, LY T679, LG T679 LS T770, LO T770, LY T770, LG T770, LP T770 LB T773, LV T773, LT T773, LW T773 LH T774 LS E675, LA E675, LY E675, LS T675 LS T776, LA T776, LO T776, LY T776, LB T776 LHGB T686 LT T68C, LB T68C - Hyper Mini TOPLED® LB M676 - Mini TOPLED Santana® LG M470 LS M47K, LO M47K, LY M47K Source: http://www.osram.convergy.de LUXEON: - LUMILED® LXK2-PW12-R00, LXK2-PW12-S00, LXK2-PW14-U00, LXK2-PW14-V00 LXK2-PM12-R00, LXK2-PM12-S00, LXK2-PM14-U00 LXK2-PE12-Q00, LXK2-PE12-R00, LXK2-PE12-S00, LXK2-PE14-T00, LXK2-PE14-U00 LXK2-PB12-K00, LXK2-PB12-L00, LXK2-PB12-M00, LXK2-PB14-N00, LXK2-PB14-P00, LXK2-PB14-Q00 LXK2-PR12-L00, LXK2-PR12-M00, LXK2-PR14-Q00, LXK2-PR14-R00 LXK2-PD12-Q00, LXK2-PD12-R00, LXK2-PD12-S00 LXK2-PH12-R00, LXK2-PH12-S00 LXK2-PL12-P00, LXK2-PL12-Q00, LXK2-PL12-R00 Source: www.luxeon.com KINGBRIGHT: KA-3528ASYC Source: www.kingbright.com
MOTOR1-MOTOR8 = HElicopterLib:BL-OUTRUNNER_2824-34
R1-R8 = resistor-shunt:SMS-0: SMD SHUNT RESISTOR; OC_FARNELL: unknown; OC_NEWARK: unknown
S1 S2 = switch:9070-2W: TOGGLE SWITCH Marquardt
T1 T2 = transistor:2N4923: NPN TRANSISTOR
TREIBER_MOTOR1-TREIBER_MOTOR8 = HElicopterLib:BL-CTRL_V1.2
U$1 U$5 = HElicopterLib:ULITMATE-GPS-PI-HAT
U$2 U$6 = HElicopterLib:LED-DRIVER
U$3 U$8 = HElicopterLib:RASPI_B+_SPANNUNGSTEILER
U$4 U$7 = bt_automotive:GND
X1 X2 = HElicopterLib:RASPI_BOARD_B+#: Raspberry Pi GPIO connector with markings for the outer dimensions of the Raspberry Pi board model B+ with different sets of drill holes or mounting pads All pins connected